# EAGLE schematic servocontroller (EAGLE 9.6.2)
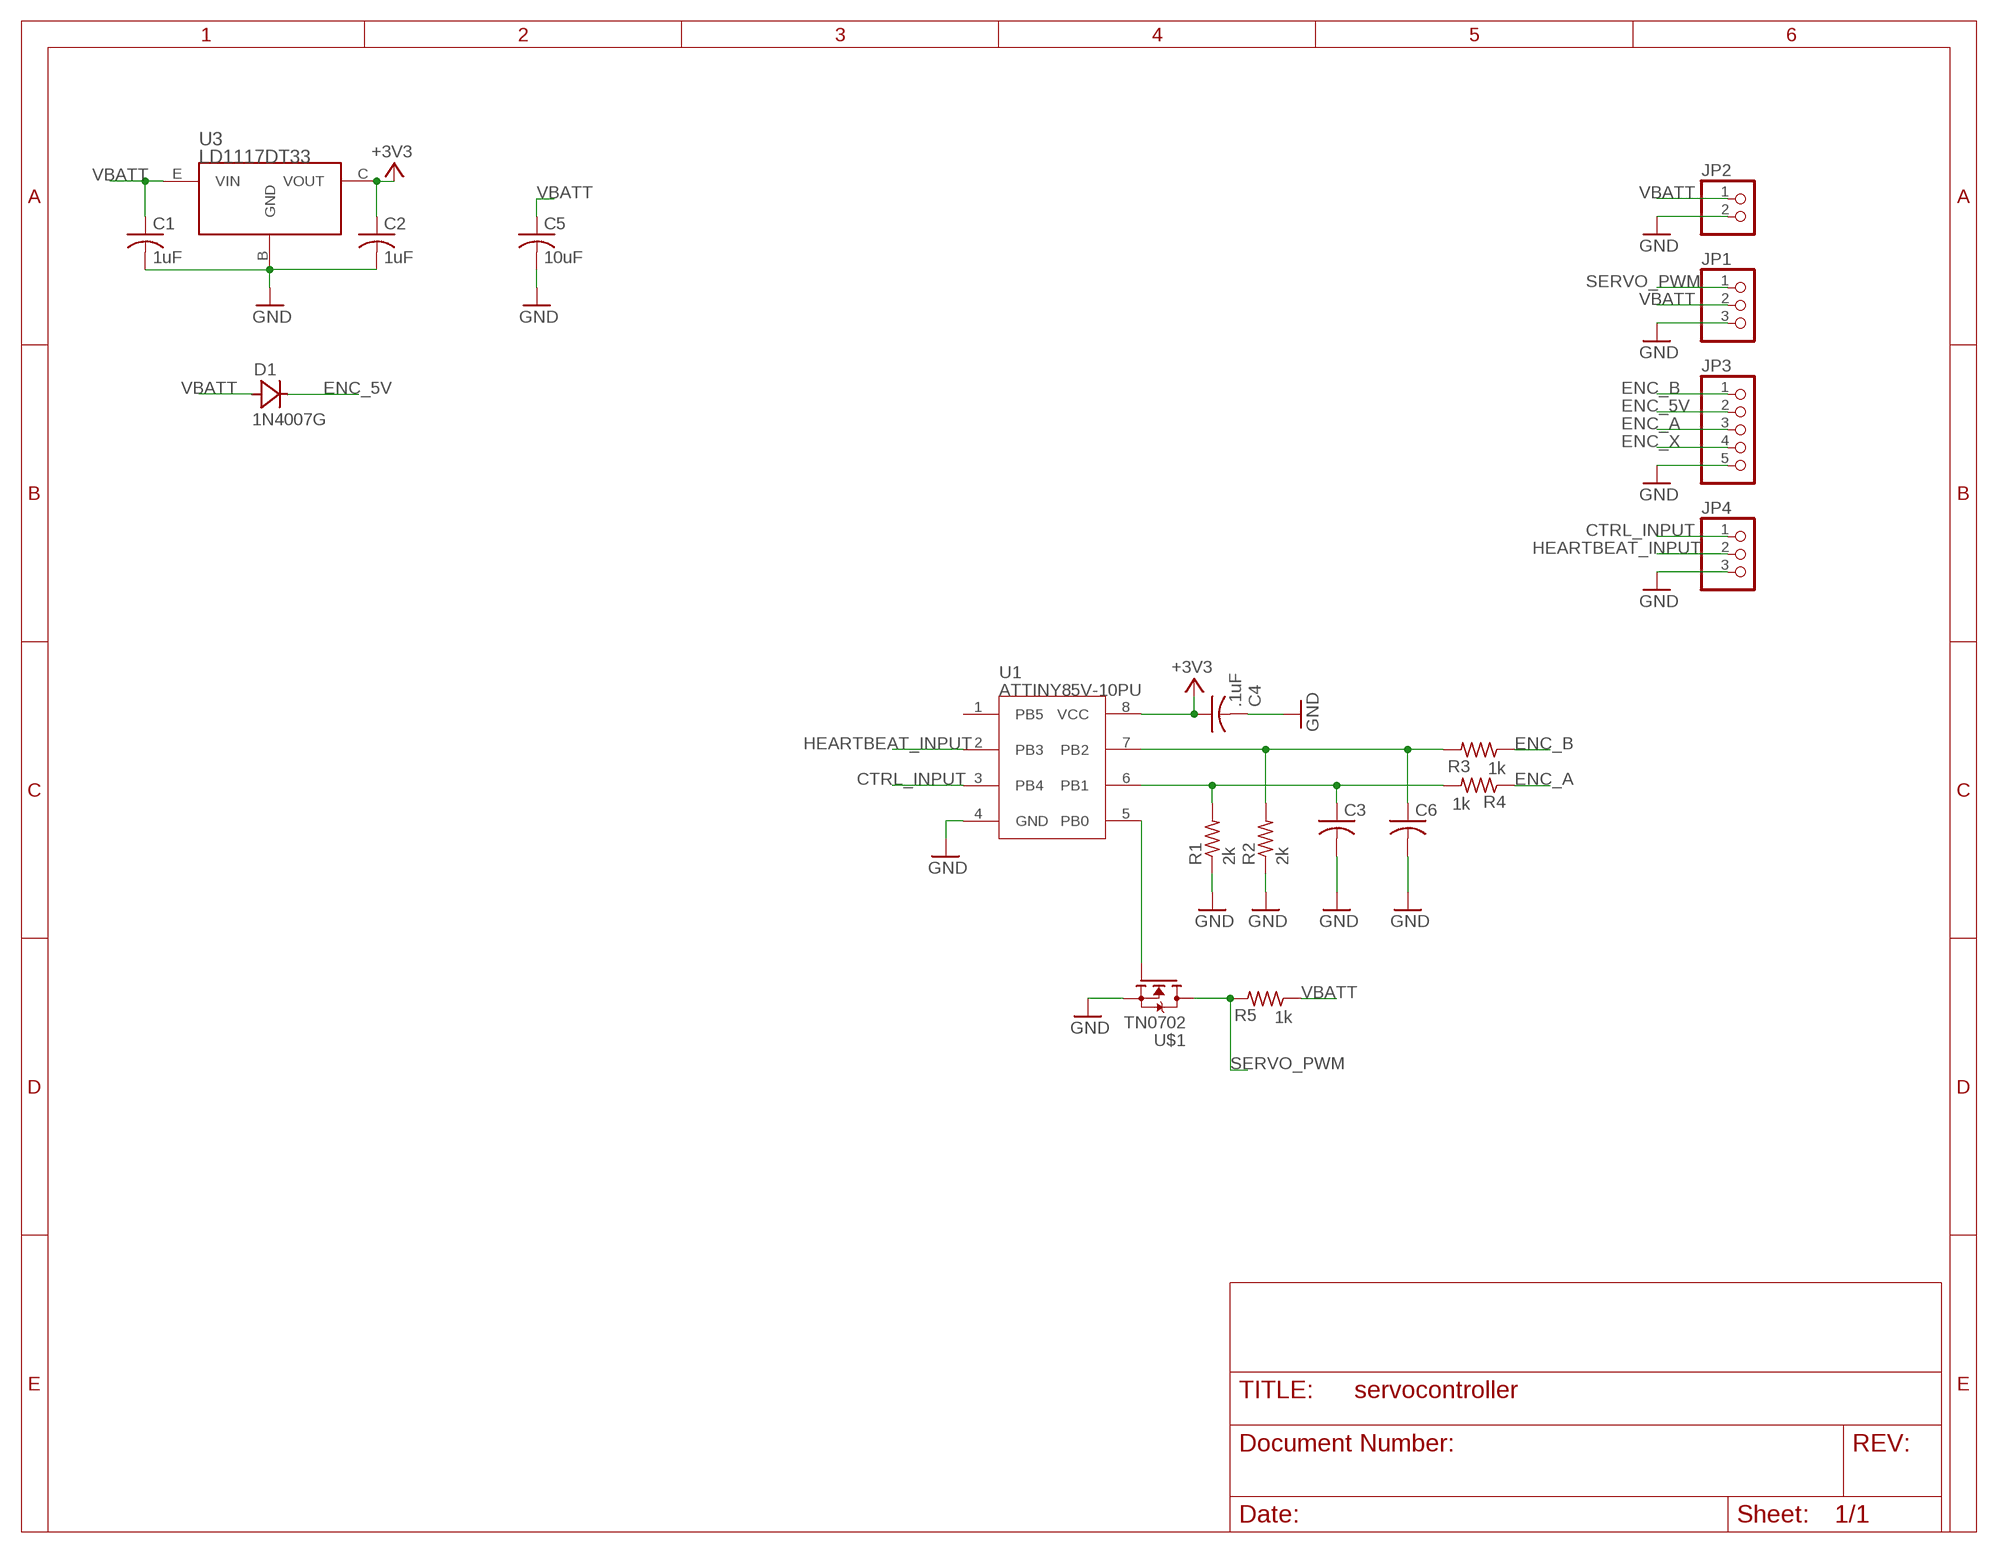
[diagram p0: schematic, sheet 1]

## Parts
C1  1uF  C-USC0805  [C0805]
C2  1uF  C-USC0805  [C0805]
C3  C-USC0805  [C0805]
C4  .1uF  C-USC0805  [C0805]
C5  10uF  C-USC0805  [C0805]
C6  C-USC0805  [C0805]
D1  1N4007G  [DO35-7A]
JP1  PINHD-1X3  [1X03]
JP2  PINHD-1X2  [1X02]
JP3  PINHD-1X5  [1X05]
JP4  PINHD-1X3  [1X03]
R1  2k  R-US_R0805  [R0805]
R2  2k  R-US_R0805  [R0805]
R3  1k  R-US_R0805  [R0805]
R4  1k  R-US_R0805  [R0805]
R5  1k  R-US_R0805  [R0805]
U1  ATTINY85V-10PU  [DIL08]
U3  LD1117DT33  [DPACK_1]
U$1  TN0702  [TO92]

## Nets
+3V3: C2.1 C4.1 U1.8(VCC) U3.C(VOUT)
CTRL_INPUT: JP4.1 U1.3(PB4)
ENC_5V: D1.C JP3.2
ENC_A: JP3.3 R4.1
ENC_B: JP3.1 R3.1
ENC_X: JP3.4
GND: C1.2 C2.2 C3.2 C4.2 C5.2 C6.2 JP1.3 JP2.2 JP3.5 JP4.3 R1.1 R2.1 U1.4(GND) U3.B(GND) U$1.3(S)
HEARTBEAT_INPUT: JP4.2 U1.2(PB3)
N$1: C6.1 R2.2 R3.2 U1.7(PB2)
N$2: C3.1 R1.2 R4.2 U1.6(PB1)
N$3: U1.5(PB0) U$1.2(G)
SERVO_PWM: JP1.1 R5.2 U$1.1(D)
VBATT: C1.1 C5.1 D1.A JP1.2 JP2.1 R5.1 U3.E(VIN)
Unconnected: U1.1(PB5)

## Library data of the parts
C1-C6 = rcl:C-US: CAPACITOR, American symbol; SPICEPREFIX: C
D1 = servocontroller:1N4007G
JP1 JP4 = pinhead:PINHD-1X3: PIN HEADER
JP2 = pinhead:PINHD-1X2: PIN HEADER
JP3 = pinhead:PINHD-1X5: PIN HEADER
R1-R5 = rcl:R-US_: RESISTOR, American symbol; SPICEPREFIX: R
U1 = servocontroller:ATTINY85V-10PU
U3 = servocontroller:LD1117DT33
U$1 = servocontroller:TN0702